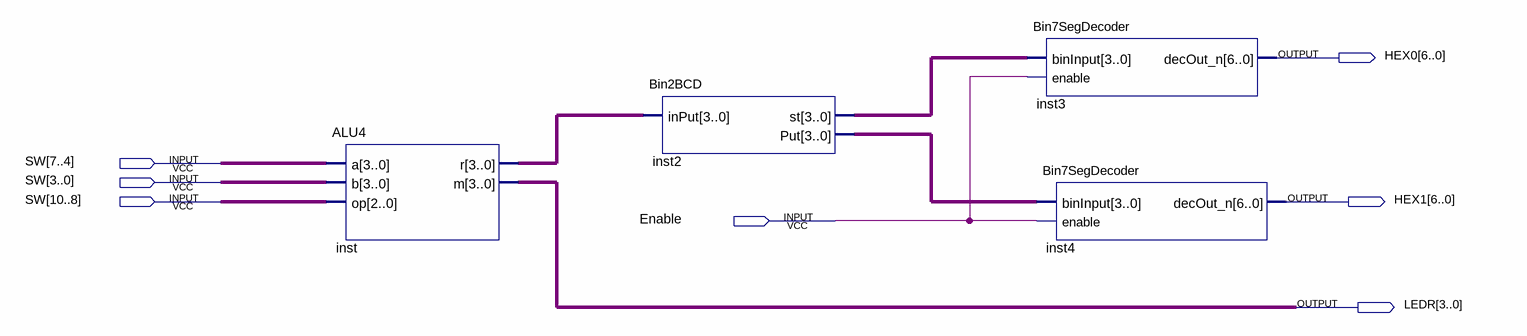
[diagram p0: schematic sheet]
// Quartus schematic ALUDemo.bdf as structural Verilog: 4 symbols, 7 pins
module ALUDemo (
  input  [10:0] SW,
  input  Enable,
  output [6:0] HEX0,
  output [6:0] HEX1,
  output [3:0] LEDR
);

  wire [3:0] inst2_put, inst2_st, inst_r;

  ALU4 inst (.a(SW[7:4]), .b(SW[3:0]), .op(SW[10:8]), .r(inst_r), .m(LEDR));
  Bin2BCD inst2 (.inPut(inst_r), .st(inst2_st), .Put(inst2_put));
  Bin7SegDecoder inst3 (.binInput(inst2_st), .enable(Enable), .decOut_n(HEX0));
  Bin7SegDecoder inst4 (.binInput(inst2_put), .enable(Enable), .decOut_n(HEX1));
endmodule
